# Altium schematic sheet OVERVIEW.SchDoc
size A4; SheetNumber: 1; SheetTotal: 5
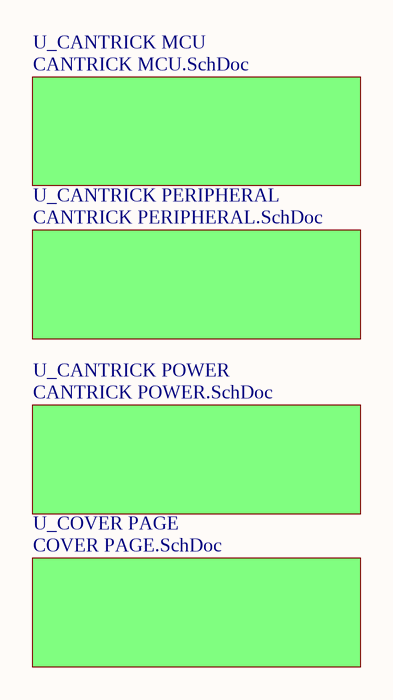
[diagram p0: OVERVIEW.SchDoc]

## Sub-sheets
U_CANTRICK MCU = CANTRICK MCU.SchDoc: no entries
U_CANTRICK PERIPHERAL = CANTRICK PERIPHERAL.SchDoc: no entries
U_CANTRICK POWER = CANTRICK POWER.SchDoc: no entries
U_COVER PAGE = COVER PAGE.SchDoc: no entries